# EAGLE design Redhat-Slate (EAGLE 7.7.0)
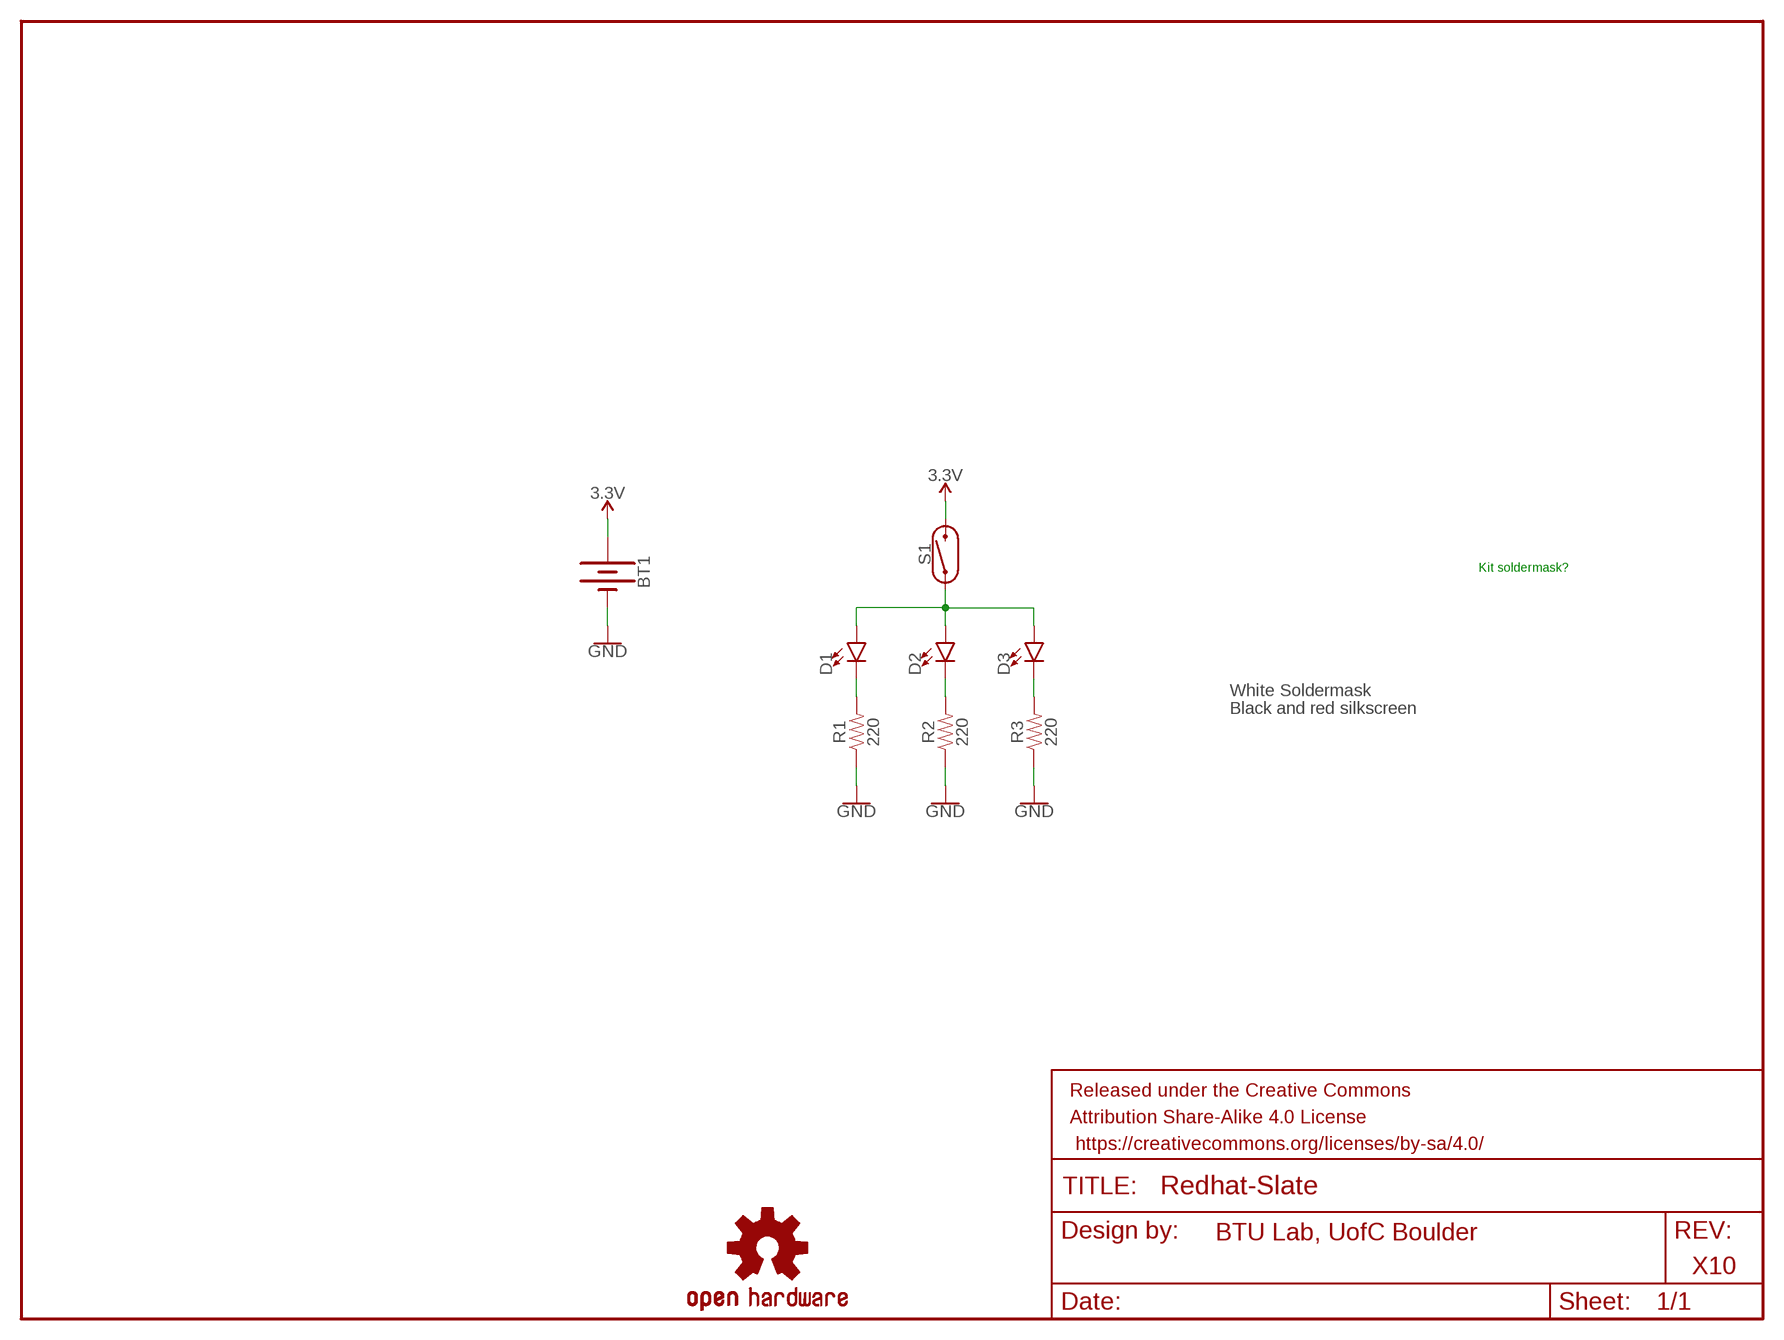
[diagram p0: schematic, sheet 1]

## Parts
BT1  BATTERY-20MM_PTH  [BATTCOM_20MM_PTH]
D1  LEDRED  [LED_5MM_EXTRASILK]
D2  LEDRED  [LED_5MM_EXTRASILK]
D3  LEDRED  [LED_5MM_EXTRASILK]
FRAME1  FRAME-LETTER  [CREATIVE_COMMONS]
LOGO4  OSHW-LOGOS  [OSHW-LOGO-S]
R1  220  1KOHM-HORIZ-1/4W-1%  [AXIAL-0.3]
R2  220  1KOHM-HORIZ-1/4W-1%  [AXIAL-0.3]
R3  220  1KOHM-HORIZ-1/4W-1%  [AXIAL-0.3]
S1  REED_SWITCH-PTH-INSULATED  [REED_SWITCH_PLASTIC]

## Nets
3.3V: BT1.1(+) S1.P$2
GND: BT1.2(-) R1.P$1 R2.P$1 R3.P$1
N$3: D1.K(C) R1.P$2
N$4: D1.A D2.A D3.A S1.P$1
N$5: D2.K(C) R2.P$2
N$7: D3.K(C) R3.P$2

## Notes on the sheet
- Kit soldermask?
- White Soldermask
- Black and red silkscreen
- BTU Lab, UofC Boulder
- X10

## Library data of the parts
BT1 = SparkFun-Batteries:BATTERY: Battery - Single Cell A variety of battery chemistries, sizes, and footprints. Device List: 20MM_PTH - Coin Cell Battery Holder - 20mm (PTH) <https://www.sparkfun.com/products/783> 12MM_SMD - Coin Cell Battery Holder - 12mm (SMD) <https://www.sparkfun.com/products/10592> 12MM_PTH - Coin Cell Battery Holder - 12mm (PTH) <https://www.sparkfun.com/products/7948> 20MM_SMD - 20mm Coin Cell Battery Holder (SMD) (2 legs) Used on the Big Time Watch Kit <https://www.sparkfun.com/products/11734> 20MM_SMD_4LEGS - Coin Cell Battery Holder - 20mm (SMD) <https://www.sparkfun.com/products/11892> 20MM_SMD_4LEGS_OVERPASTE - Coin Cell Battery Holder - 20mm (SMD) <https://www.sparkfun.com/products/11892> (Over-paste on the legs) 24.5MM_PTH - Coin Cell Battery Holder - 24.5mm (PTH) <https://www.sparkfun.com/products/8863> 9V - 9V Battery Holder - PC Mount Used on the SparkFun SparkPunk Sound Kit <https://www.sparkfun.com/products/11177> and SparkFun SparkPunk Sequencer Kit <https://www.sparkfun.com/products/12707> 18650 - Battery Holder - 18650 (PTH) <https://www.sparkfun.com/products/13113> AA - Battery Holder - 1xAA (PTH) <https://www.sparkfun.com/products/7949> AAA - Battery Holder - 1xAAA (PTH) <https://www.sparkfun.com/products/12718> AA_KIT - Battery Holder - 1xAA (PTH) <https://www.sparkfun.com/products/7949> Special kit package - pads only have exposed copper on one side of the board. AAA_KIT - Battery Holder - 1xAAA (PTH) <https://www.sparkfun.com/products/12718> Special kit package - pads only have exposed copper on one side of the board.; PROD_ID: BATT-09031; SF_SKU: PRT-00783
D1-D3 = SparkX:LED
FRAME1 = SparkFun-Aesthetics:FRAME-LETTER: Schematic Frame - Letter Standard 8.5x11 US Letter frame
LOGO4 = SparkFun-Aesthetics:OSHW-LOGO: Open-Source Hardware (OSHW) Logo This logo indicates the piece of hardware it is found on incorporates a OSHW license and/or adheres to the definition of open source hardware found here: http://freedomdefined.org/OSHW
R1-R3 = SparkFun-Resistors:1KOHM: 1kΩ resistor A resistor is a passive two-terminal electrical component that implements electrical resistance as a circuit element. Resistors act to reduce current flow, and, at the same time, act to lower voltage levels within circuits. - Wikipedia; PROD_ID: RES-12182; VALUE: 1k
S1 = SparkFun-Switches:REED_SWITCH: Reed Switch A reed switch is a magnetically-actuated switch. When the device is exposed to a magnetic field, the two ferrous materials inside the switch pull together and the switch closes. Variant Overview PTH-GLASS Reed Switch <https://www.sparkfun.com/products/8642> (COM-08642) - PTH reed switch w/ glass body (6.0 x 0.9 mm) PTH-INSULATED Reed Switch - Insulated <https://www.sparkfun.com/products/10601> (COM-10601) - PTH reed switch w/ insulated body (15.1 x 4.2 mm); PROD_ID: SWCH-10467; SF_SKU: COM-10601

## Board
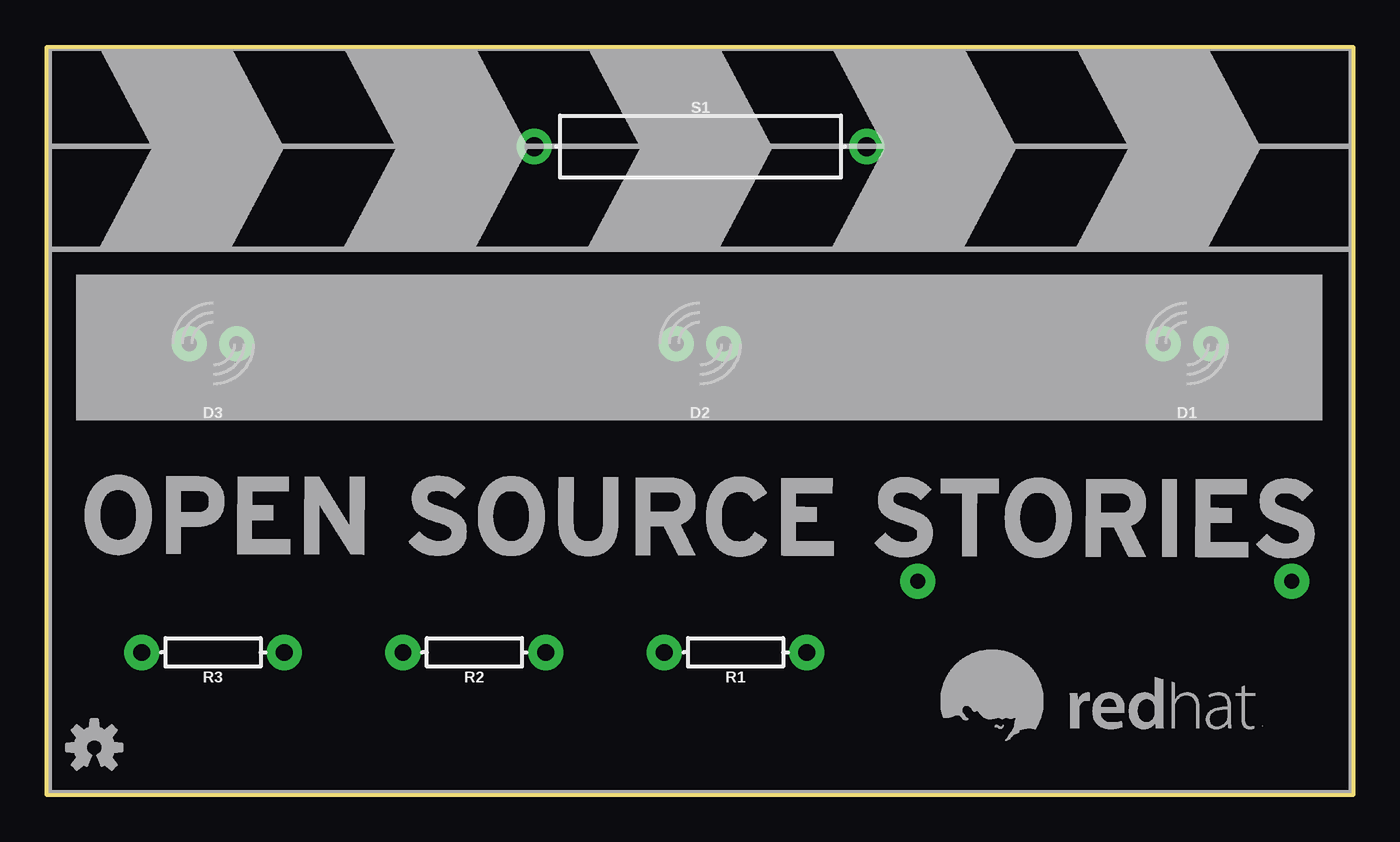
[diagram p1: board, top side]
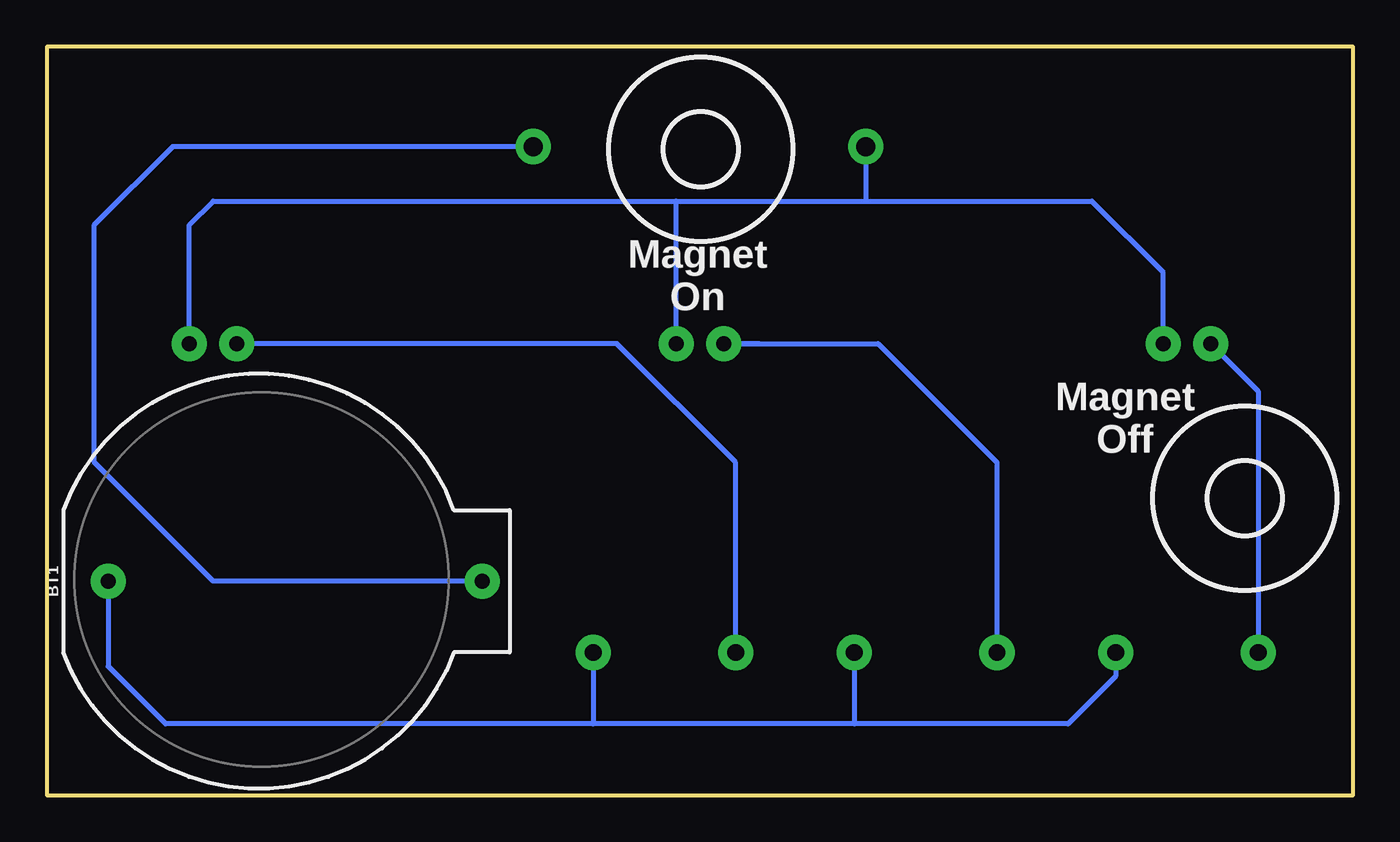
[diagram p2: board, bottom side, seen from below]

Size 69.85 x 40.01 mm. Coordinates in mm from the lower left corner, seen from the top.
Outline: 0,0 0,40.01 69.85,40.01 69.85,0 0,0
Copper layers (1*16): Top 0.035mm / dielectric 1.5mm / Bottom 0.035mm
Design rules "SparkFun-2-layer-TIGHT": minimum track width 7mil, minimum drill 15mil, track to track 7mil, track to pad 7mil, pad to pad 7mil, via to via 7mil, smd to smd 7mil, copper to edge 7mil, drill to drill 7mil, minimum pad ring 7mil, minimum via ring 7mil, stop-mask expansion 4mil, vias tented up to drill 25mil, thermal gap 10mil

### Footprints (pad centres in the part's own frame; a part is rotated, then mirrored left to right if it is on the bottom)
BATTCOM_20MM_PTH = drill 0.813 pad 1.88: 1 11.85,0; 2 -8.15,0
LED_5MM_EXTRASILK = drill 0.813 pad 1.88: A -1.27,0; K 1.27,0
AXIAL-0.3 = drill 0.9 pad 1.88: P$1 -3.81,0; P$2 3.81,0
REED_SWITCH_PLASTIC = drill 1.016 pad 1.88: P$1 -8.89,0; P$2 8.89,0

### Placement (x,y rotation side)
BT1  58.42,11.43 0 bottom
D1  60.96,24.13 180 top
D2  34.92,24.13 180 top
D3  8.89,24.13 180 top
FRAME1  -13.97,-21.59 0 top  (outside the outline)
LOGO4  2.54,2.54 0 top
R1  36.83,7.62 180 top
R2  22.86,7.62 180 top
R3  8.89,7.62 180 top
S1  34.95,34.67 0 top

### Tracks (layer width: path | path; a pad name or v marks a point on that pad's centre or on a via)
3.3V
  Bottom 0.254: S1.P$2 63.12,34.67 67.31,30.48 67.31,17.78 60.96,11.43 BT1.1
GND
  Bottom 0.254: 26.67,3.81 15.24,3.81 12.7,6.35 R3.P$1 | 26.67,3.81 40.64,3.81 | 40.64,3.81 63.5,3.81 66.57,6.88 BT1.2 | R1.P$1 40.64,3.81 | R2.P$1 26.67,3.81
N$3
  Bottom 0.254: D1.K 39.37,24.13 33.02,17.78 R1.P$2
N$4
  Bottom 0.254: D1.A 62.23,30.48 60.96,31.75 36.2,31.75 | 36.2,31.75 26.09,31.75 | 26.09,31.75 13.97,31.75 10.16,27.94 D3.A | S1.P$1 26.06,31.77 26.09,31.75 | D2.A 36.2,31.75
N$5
  Bottom 0.254: 31.78,24.13 D2.K 25.4,24.13 19.05,17.78 R2.P$2
N$7
  Bottom 0.254: 7.64,24.15 D3.K 5.08,21.59 R3.P$2

### Text on the board
Dimension: White Soldermask / / First top silk: Black [File GTO] / Second top silk: Red [File GTR] / / Bottom silk: Black [File GBO]
bPlace: Magnet / On | Magnet / Off
tDocu: BTU Lab, UofC Boulder